# Altium project PnP-Bench-ResCaps.PrjPcb
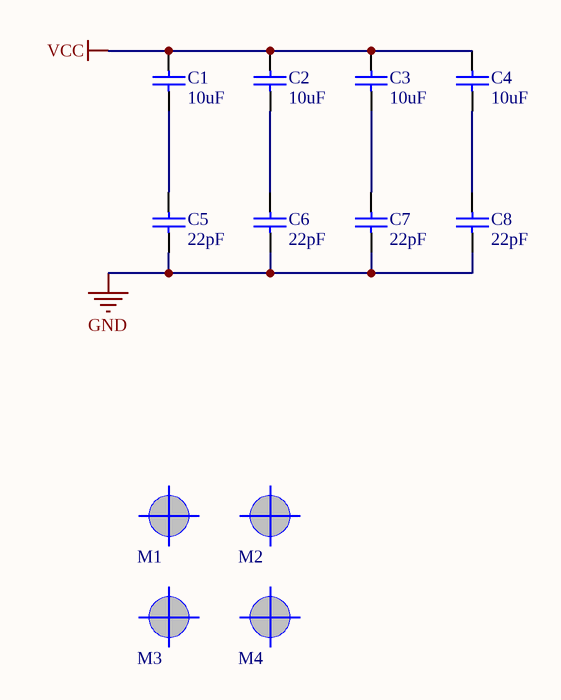
[diagram p0: Caps.SchDoc]
1 sheet, 12 parts. Net scope: global (net labels, ports and power ports of the same name join across sheets).
Board file: ResCaps.PcbDoc

## Sheet Caps.SchDoc
size A4

### Parts
C1  10uF  [CAP-1206]
C2  10uF  [CAP-1206]
C3  10uF  [CAP-1206]
C4  10uF  [CAP-1206]
C5  22pF  [CAP-0402]
C6  22pF  [CAP-0402]
C7  22pF  [CAP-0402]
C8  22pF  [CAP-0402]
M1  Screw hole  [MECH-SCREW-M2.3]  (value not drawn)
M2  Screw hole  [MECH-SCREW-M2.3]  (value not drawn)
M3  Screw hole  [MECH-SCREW-M2.3]  (value not drawn)
M4  Screw hole  [MECH-SCREW-M2.3]  (value not drawn)

### Nets
GND: C5.1 C6.1 C7.1 C8.1
VCC: C1.2 C2.2 C3.2 C4.2
NetC1_1: C1.1 C5.2
NetC2_1: C2.1 C6.2
NetC3_1: C3.1 C7.2
NetC4_1: C4.1 C8.2

### Library data of the parts
C1-C8 = Cap: Capacitor; Published: 8-Jun-2000; LatestRevisionDate: 17-Jul-2002; LatestRevisionNote: Re-released for DXP Platform.; PackageReference: RAD-0.3; Publisher: Altium Limited; PackageDescription: Radial Cap, Thru-Hole; 2 Leads; 0.3 in Pin Spacing
  C1-C4: Value: 10uF
  C5-C8: Value: 22pF